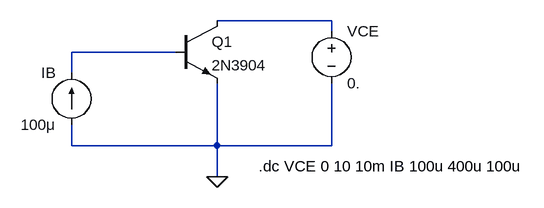
[diagram p0: schematic BJT_transistors2.asc]
BJT_transistors2.asc, the LTspice schematic file:
Version 4.1
SHEET 1 880 680
WIRE 384 80 208 80
WIRE 384 96 384 80
WIRE 144 128 -16 128
WIRE -16 160 -16 128
WIRE -16 272 -16 240
WIRE 208 272 208 176
WIRE 208 272 -16 272
WIRE 384 272 384 176
WIRE 384 272 208 272
WIRE 208 320 208 272
FLAG 208 320 0
SYMBOL npn 144 80 R0
SYMATTR InstName Q1
SYMATTR Value 2N3904
SYMBOL voltage 384 80 R0
WINDOW 123 0 0 Left 0
WINDOW 39 0 0 Left 0
SYMATTR InstName VCE
SYMATTR Value 0.
SYMBOL current -16 240 R180
WINDOW 0 24 80 Left 2
WINDOW 3 24 0 Left 2
SYMATTR InstName IB
SYMATTR Value 100μ
TEXT 272 304 Left 2 !.dc VCE 0 10 10m IB 100u 400u 100u

The netlist it stands for:
* BJT_transistors2.asc
Q1 N001 N002 0 0 2N3904
VCE N001 0 0.
IB 0 N002 100μ
.model NPN NPN
.model PNP PNP
.lib standard.bjt
.dc VCE 0 10 10m IB 100u 400u 100u
.backanno
.end